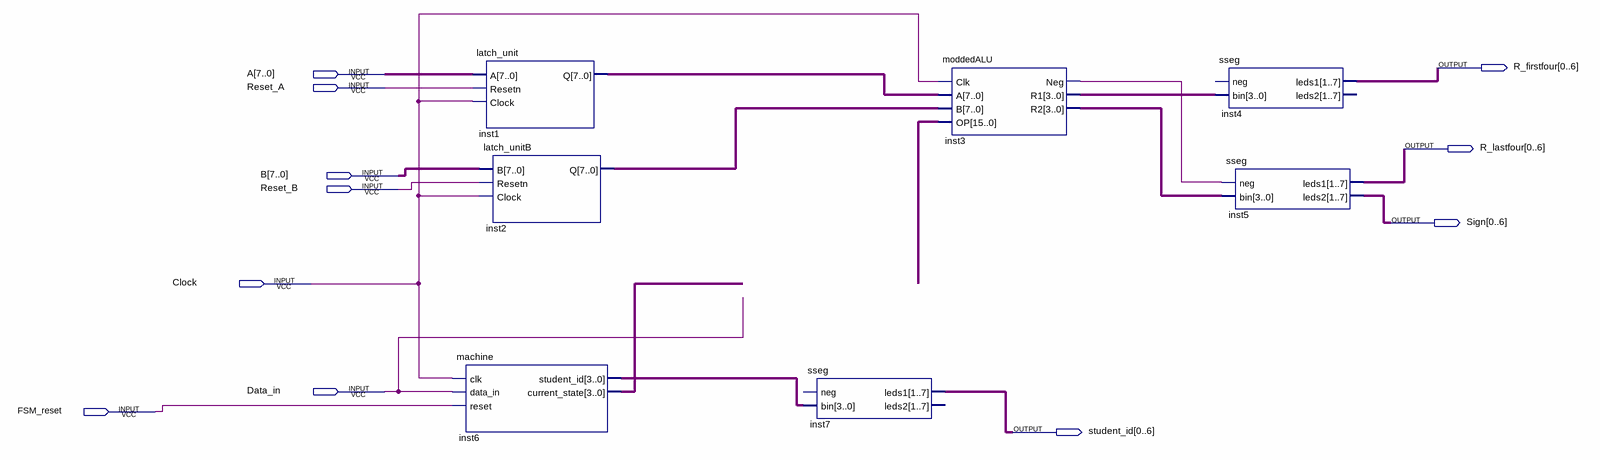
[diagram p0: schematic sheet]
// Quartus schematic Block2.bdf as structural Verilog: 7 symbols, 11 pins
module Block2 (
  input  [7:0] A,
  input  Reset_A,
  input  [7:0] B,
  input  Reset_B,
  input  Clock,
  input  Data_in,
  input  FSM_reset,
  output [0:6] R_firstfour,
  output [0:6] R_lastfour,
  output [0:6] Sign,
  output [0:6] student_id
);

  wire inst3_neg;
  wire [3:0] inst3_r1, inst3_r2, inst6_current_state, inst6_student_id;
  wire [7:0] inst1_q, inst2_q;
  wire [15:0] undriven;

  machine inst6 (
    .clk(Clock), .data_in(Data_in), .reset(FSM_reset), .student_id(inst6_student_id),
    .current_state(inst6_current_state));
  latch_unit inst1 (.A(A), .Resetn(Reset_A), .Clock(Clock), .Q(inst1_q));
  latch_unitB inst2 (.B(B), .Resetn(Reset_B), .Clock(Clock), .Q(inst2_q));
  sseg inst7 (.bin(inst6_student_id), .leds1(student_id));  // open: neg, leds2
  moddedALU inst3 (.Clk(Clock), .A(inst1_q), .B(inst2_q), .OP(undriven), .Neg(inst3_neg), .R1(inst3_r1), .R2(inst3_r2));
  sseg inst4 (.bin(inst3_r1), .leds1(R_firstfour));  // open: neg, leds2
  sseg inst5 (.neg(inst3_neg), .bin(inst3_r2), .leds1(R_lastfour), .leds2(Sign));
endmodule
